# EAGLE design dan64 (EAGLE 8.3.2)
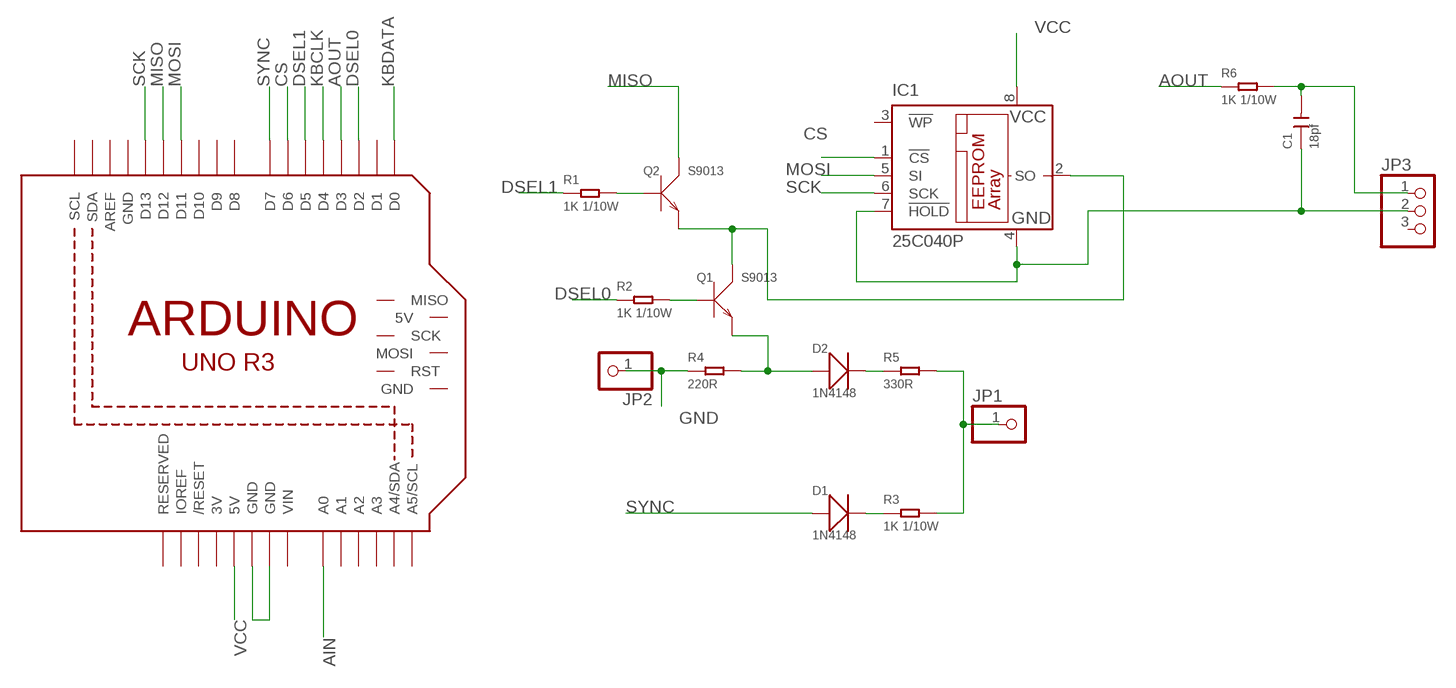
[diagram p0: schematic, sheet 1]

## Parts
C1  18pf  CERAMIC-18PF-50V-5%-NPO(0402)  [C0402]
D1  1N4148  SMD-DIODE-SWITCH-1N4148(LL-34)  [LL-34]
D2  1N4148  SMD-DIODE-SWITCH-1N4148(LL-34)  [LL-34]
IC1  25C040P  [DIL8]
JP1  PINHD-1X1  [1X01]
JP2  PINHD-1X1  [1X01]
JP3  PINHD-1X3  [1X03]
M1  ARDUINO_R3_ICSP  [ARDUINOR3_ICSP]
Q1  S9013  SMD-TRANSISTORS-NPN-25V-500MA-S9013(SOT-23)  [SOT-23]
Q2  S9013  SMD-TRANSISTORS-NPN-25V-500MA-S9013(SOT-23)  [SOT-23]
R1  1K 1/10W  SMD-RES-1K-5%-1/10W(0603)  [R0603]
R2  1K 1/10W  SMD-RES-1K-5%-1/10W(0603)  [R0603]
R3  1K 1/10W  SMD-RES-1K-5%-1/10W(0603)  [R0603]
R4  220R  SMD-RES-220R-5%-1/10W(0603)  [R0603]
R5  330R  SMD-RES-330R-1%-1/10W(0603)  [R0603]
R6  1K 1/10W  SMD-RES-1K-5%-1/10W(0603)  [R0603]

## Nets
AIN: M1.A0
AOUT: M1.D3 R6.1
CS: IC1.1(!CS) M1.D6
DSEL0: M1.D2 R2.1
DSEL1: M1.D5 R1.1
GND: C1.1 IC1.4(GND) IC1.7(!HOLD) JP2.1 JP3.2 M1.GND@1(GND) M1.GND@3(GND) R4.1
KBCLK: M1.D4
KBDATA: M1.D0
MISO: M1.D12 Q2.3(C)
MOSI: IC1.5(SI) M1.D11
N$1: D2.C(-) R5.1
N$2: D1.C(-) R3.1
N$3: JP1.1 R3.2 R5.2
N$4: D2.A(+) Q1.2(E) R4.2
N$6: Q1.1(B) R2.2
N$7: C1.2 JP3.1 R6.2
N$8: Q2.1(B) R1.2
N$10: IC1.2(SO) Q1.3(C) Q2.2(E)
SCK: IC1.6(SCK) M1.D13
SYNC: D1.A(+) M1.D7
VCC: IC1.8(VCC) M1.5V
Unconnected: IC1.3(!WP) JP3.3 M1.5V_ICSP(5V) M1.A1 M1.A2 M1.A3 M1.A4(A4/SDA) M1.A5(A5/SCL) M1.AREF M1.D1 M1.D8 M1.D9 M1.D10 M1.GND@2(GND) M1.IOREF M1.MISO M1.MOSI M1.RESERVED M1.RESET(/RESET) M1.RESET_ICSP(RST) M1.SCK M1.SCL M1.SDA

## Power pins joined to a net without a drawn wire
3V: M1.3V
GND: M1.GND
VIN: M1.VIN

## Library data of the parts
C1 = Seeed-Capacitor:CERAMIC-18PF-50V-5%-NPO(0402): 302010016; MPN: CC0402JRNPO9BN180
D1 D2 = Seeed-Diode:SMD-DIODE-SWITCH-1N4148(LL-34): 304040016; MPN: 1N4148
IC1 = microchip:25*: Serial EEPROM 4K/ 8K , SPI bus; MF: MICROCHIP; MPN: 25C040/P; OC_FARNELL: 1607554; OC_NEWARK: 96K4084
JP1 JP2 = adafruit:PINHD-1X1: Pin header 1x1 for 0.1" spacing With round pins
JP3 = adafruit:PINHD-1X3: PIN HEADER
M1 = adafruit:ARDUINO_R3_ICSP
Q1 Q2 = Seeed-Transistor:SMD-TRANSISTORS-NPN-25V-500MA-S9013(SOT-23): 305010018; MPN: S9013
R1-R3 R6 = Seeed-Resistor:SMD-RES-1K-5%-1/10W(0603): 301010291; MPN: RC0603JR-071KL
R4 = Seeed-Resistor:SMD-RES-220R-5%-1/10W(0603): 301010163; MPN: RC0603JR-07220RL
R5 = Seeed-Resistor:SMD-RES-330R-1%-1/10W(0603): 301010300; MPN: RC0603FR-07330RL

## Board
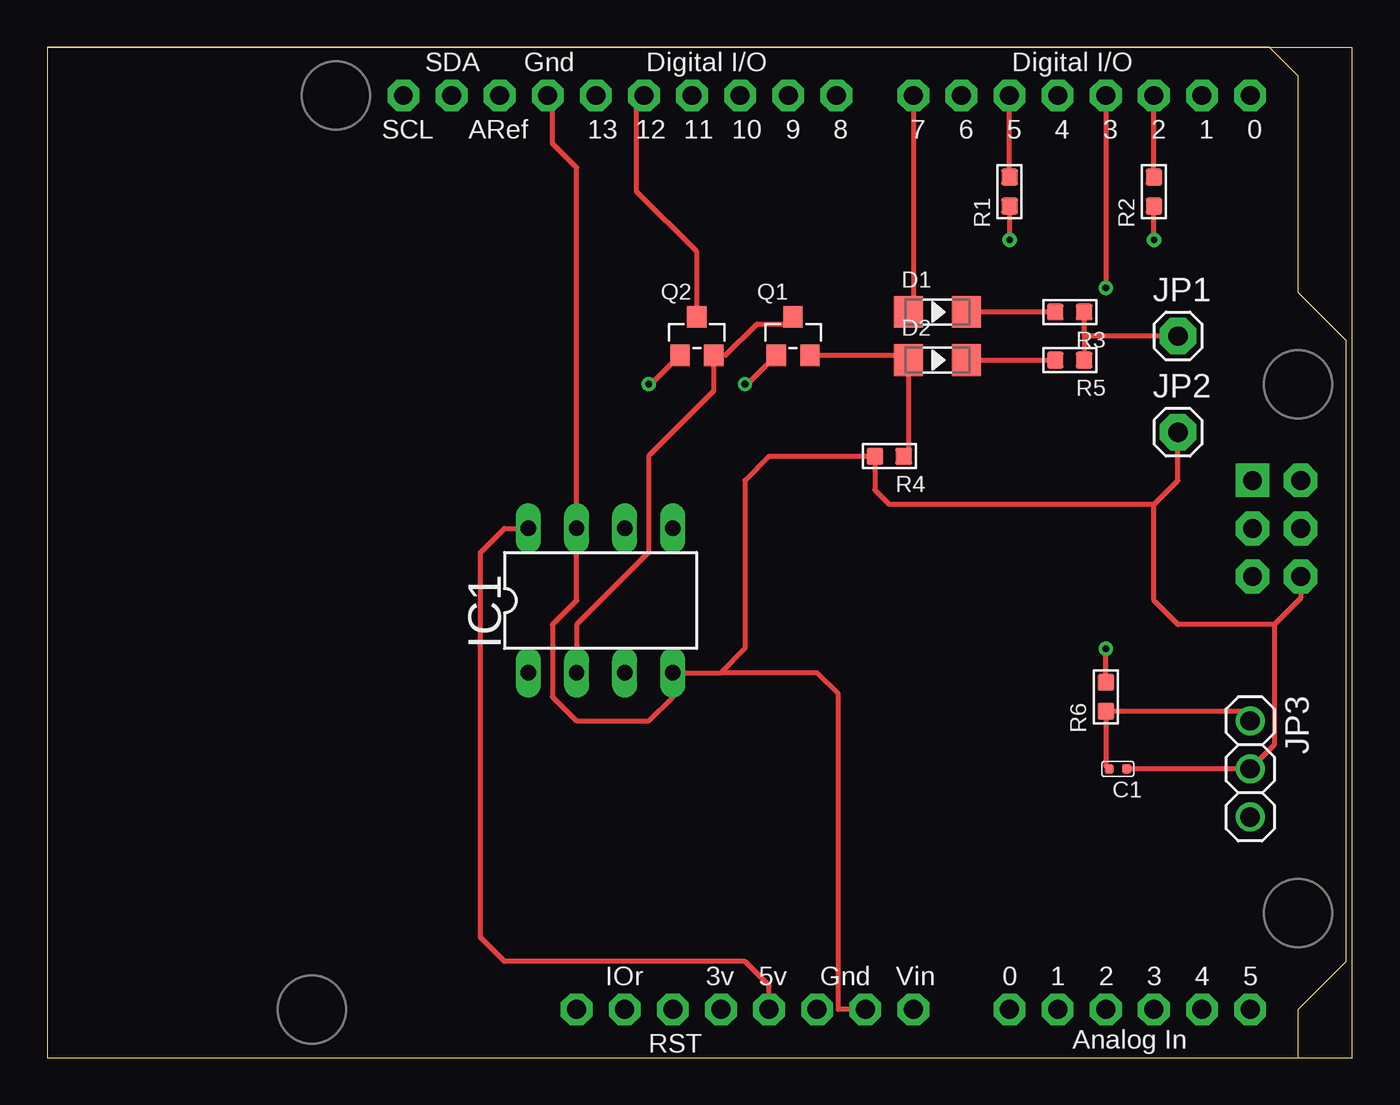
[diagram p1: board, top side]
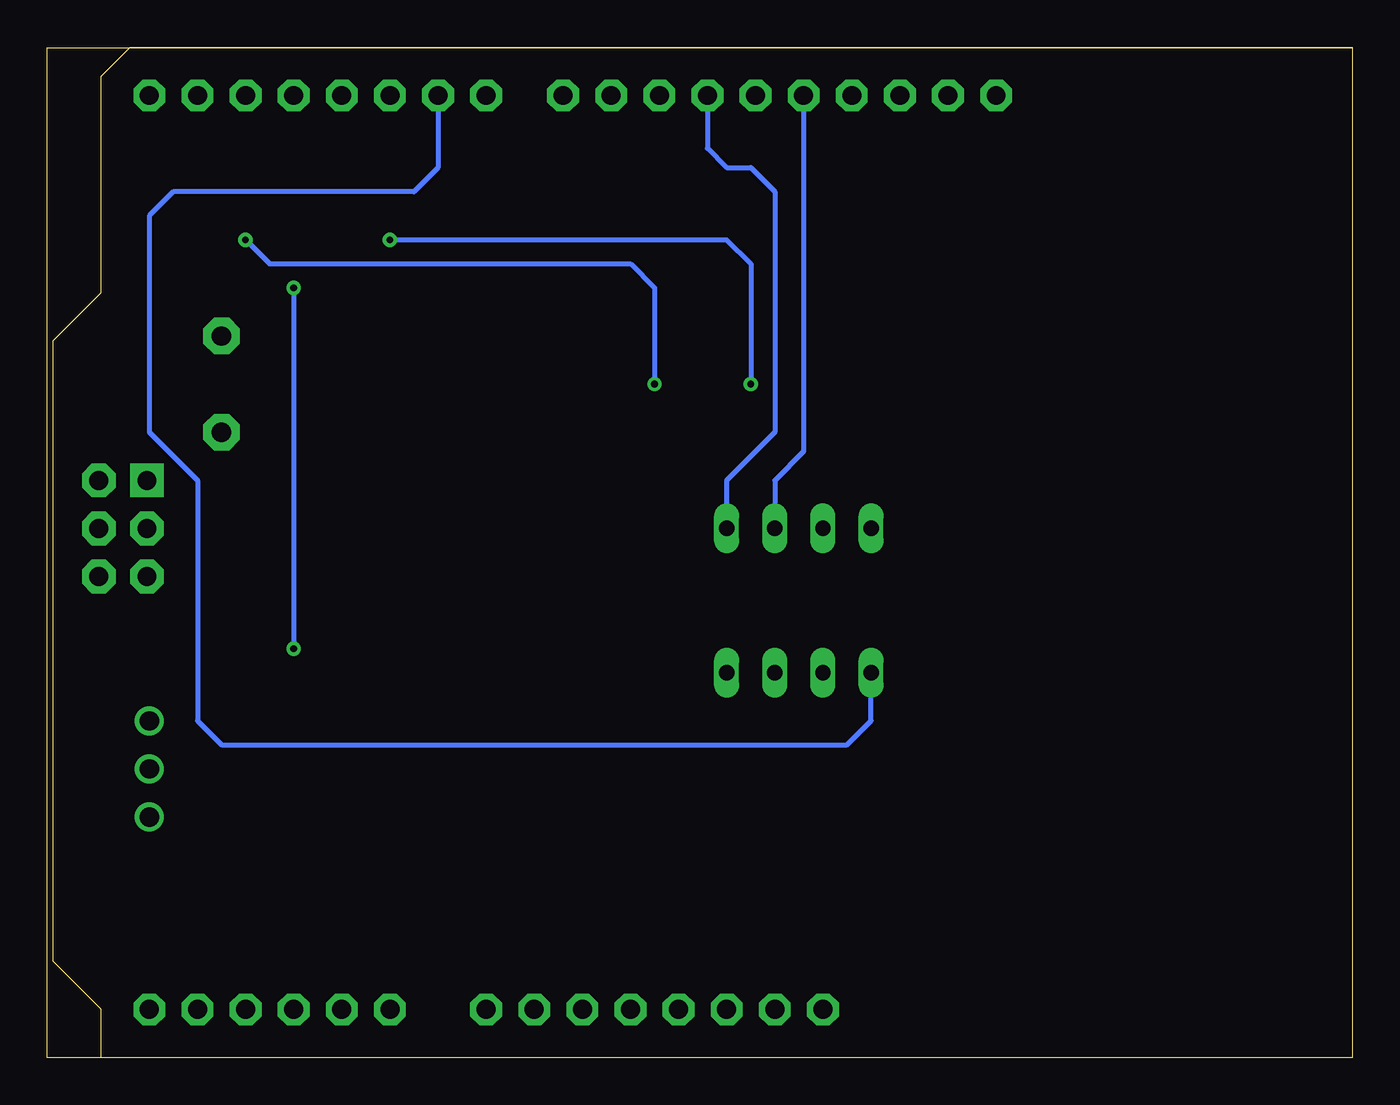
[diagram p2: board, bottom side, seen from below]

Size 68.89 x 53.34 mm. Coordinates in mm from the lower left corner, seen from the top.
Outline: 0,0 68.89,0 68.89,53.33 0,53.33 0,0
Copper layers (1*16): Top 0.035mm / dielectric 1.5mm / Bottom 0.035mm
Design rules "default": minimum track width 6mil, minimum drill 0.35mm, track to track 6mil, track to pad 6mil, pad to pad 6mil, via to via 6mil, smd to smd 6mil, copper to edge 40mil, drill to drill 6mil, minimum pad ring 10mil, minimum via ring 8mil, stop-mask expansion 4mil, vias tented up to drill 0mil, thermal gap 10mil

### Footprints (pad centres in the part's own frame; a part is rotated, then mirrored left to right if it is on the bottom)
C0402 = smd 0.5 x 0.5: 1 0,0.463; 2 0,-0.463
LL-34 = smd 1.524 x 1.676: A -1.524,0; C 1.524,0
DIL8 = drill 0.813 long: 1 -3.81,-3.81; 2 -1.27,-3.81; 3 1.27,-3.81; 4 3.81,-3.81; 5 3.81,3.81; 6 1.27,3.81; 7 -1.27,3.81; 8 -3.81,3.81
1X01 = drill 1.016 pad 1.93 octagon: 1 0,0
1X03 = drill 1.016: 1 -2.54,0; 2 0,0; 3 2.54,0
ARDUINOR3_ICSP = drill 1 pad 1.676 octagon: 3V 35.56,2.54; 5V 38.1,2.54; A0 50.8,2.54; A1 53.34,2.54; A2 55.88,2.54; A3 58.42,2.54; A4 60.96,2.54; A5 63.5,2.54; AREF 23.876,50.8; D0 63.5,50.8; D1 60.96,50.8; D2 58.42,50.8; D3 55.88,50.8; D4 53.34,50.8; D5 50.8,50.8; D6 48.26,50.8; D7 45.72,50.8; D8 41.656,50.8; D9 39.116,50.8; D10 36.576,50.8; D11 34.036,50.8; D12 31.496,50.8; D13 28.956,50.8; GND 26.416,50.8; GND@1 43.18,2.54; GND@2 40.64,2.54; IOREF 30.48,2.54; RESERVED 27.94,2.54; RESET 33.02,2.54; SCL 18.796,50.8; SDA 21.336,50.8; VIN 45.72,2.54 | drill 1 pad 1.778 octagon: 5V_ICSP 66.167,30.48; GND@3 66.167,25.4; MOSI 66.167,27.94; RESET_ICSP 63.627,25.4; SCK 63.627,27.94 | drill 1 pad 1.778 square: MISO 63.627,30.48
SOT-23 = smd 1.016 x 1.143: 1 -0.889,-1.016; 2 0.889,-1.016; 3 0,1.016
R0603 = smd 0.889 x 0.889: 1 0,0.762; 2 0,-0.762

### Placement (x,y rotation side)
C1  56.52,15.24 270 top
D1  46.99,39.37 0 top
D2  46.99,36.83 0 top
IC1  29.21,24.13 0 top
JP1  59.69,38.1 0 top
JP2  59.69,33.02 0 top
JP3  63.5,15.24 270 top
M1  0,0 0 top
Q1  39.37,38.1 0 top
Q2  34.29,38.1 0 top
R1  50.8,45.72 0 top
R2  58.42,45.72 0 top
R3  53.98,39.37 90 top
R4  44.45,31.75 90 top
R5  53.98,36.83 90 top
R6  55.88,19.05 0 top

### Tracks (layer width: path | path; a pad name or v marks a point on that pad's centre or on a via)
AOUT  (via drill 0.35)
  Top 0.254: R6.1 v55.88,21.59 | M1.D3 v55.88,40.64
  Bottom 0.254: v55.88,40.64 v55.88,21.59
CS
  Bottom 0.254: IC1.1 25.4,17.78 26.67,16.51 59.69,16.51 60.96,17.78 60.96,30.48 63.5,33.02 63.5,44.45 62.23,45.72 49.53,45.72 48.26,46.99 M1.D6
DSEL0
  Top 0.254: R2.1 M1.D2
DSEL1
  Top 0.254: R1.1 M1.D5
GND
  Top 0.254: 35.56,20.32 36.83,21.59 36.83,30.48 38.1,31.75 R4.1 43.69,29.97 44.45,29.21 58.42,29.21 | 35.56,20.32 IC1.4 33.02,19.05 31.75,17.78 27.94,17.78 26.67,19.05 26.67,22.86 27.94,24.13 IC1.7 27.94,46.99 26.67,48.26 26.67,50.55 M1.GND | M1.GND@1 41.76,2.54 41.76,19.2 40.64,20.32 35.56,20.32 | 58.42,29.21 59.69,30.48 JP2.1 | M1.GND@3 66.17,24.26 64.77,22.86 | 64.77,22.86 59.69,22.86 58.42,24.13 58.42,29.21 | C1.1 JP3.2 64.77,16.51 64.77,22.86
MISO
  Top 0.254: Q2.3 34.29,42.55 31.11,45.72 31.11,50.42 M1.D12
MOSI
  Bottom 0.254: M1.D11 34.04,48.01 33.02,46.99 31.75,46.99 30.48,45.72 30.48,33.02 33.02,30.48 IC1.5
N$1
  Top 0.254: D2.C R5.1
N$2
  Top 0.254: R3.1 D1.C
N$3
  Top 0.254: 54.74,38.1 R5.2 | 54.74,38.1 R3.2 | JP1.1 54.74,38.1
N$4
  Top 0.254: R4.2 45.47,32 D2.A 45.21,37.08 Q1.2
N$6  (via drill 0.35)
  Top 0.254: v58.42,43.18 R2.2 | v36.83,35.56 36.96,35.56 Q1.1
  Bottom 0.254: v58.42,43.18 57.15,41.91 38.1,41.91 36.83,40.64 v36.83,35.56
N$7
  Top 0.254: JP3.1 62.99,18.29 R6.2 55.88,15.41 C1.2
N$8  (via drill 0.35)
  Top 0.254: R1.2 v50.8,43.18 | v31.75,35.56 31.88,35.56 Q2.1
  Bottom 0.254: v50.8,43.18 33.02,43.18 31.75,41.91 v31.75,35.56
N$10
  Top 0.254: Q1.3 38.99,38.73 37.47,38.73 35.81,37.08 Q2.2 35.18,35.18 31.75,31.75 31.75,26.67 27.94,22.86 IC1.2
SCK
  Bottom 0.254: M1.D13 28.96,32 30.48,30.48 IC1.6
SYNC
  Top 0.254: M1.D7 45.72,39.62 D1.A
VCC
  Top 0.254: M1.5V 38.1,3.81 36.83,5.08 24.13,5.08 22.86,6.35 22.86,26.67 24.13,27.94 IC1.8